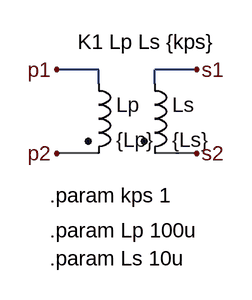
[diagram p0: schematic transformer_cu_core.asc]
transformer_cu_core.asc, the LTspice schematic file:
Version 4
SHEET 1 880 680
WIRE 160 80 112 80
WIRE 272 80 224 80
WIRE 160 96 160 80
WIRE 224 96 224 80
WIRE 160 176 112 176
WIRE 272 176 224 176
FLAG 112 80 p1
FLAG 112 176 p2
FLAG 272 80 s1
FLAG 272 176 s2
SYMBOL ind2 144 80 R0
SYMATTR InstName Lp
SYMATTR Value {Lp}
SYMATTR Type ind
SYMBOL ind2 208 80 R0
SYMATTR InstName Ls
SYMATTR Value {Ls}
SYMATTR Type ind
TEXT 104 224 Left 2 !.param kps 1
TEXT 104 264 Left 2 !.param Lp 100u
TEXT 104 296 Left 2 !.param Ls 10u
TEXT 136 48 Left 2 !K1 Lp Ls {kps}

The netlist it stands for:
* transformer_cu_core.asc
Lp p1 p2 {Lp}
Ls s1 s2 {Ls}
.param kps 1
.param Lp 100u
.param Ls 10u
K1 Lp Ls {kps}
.backanno
.end